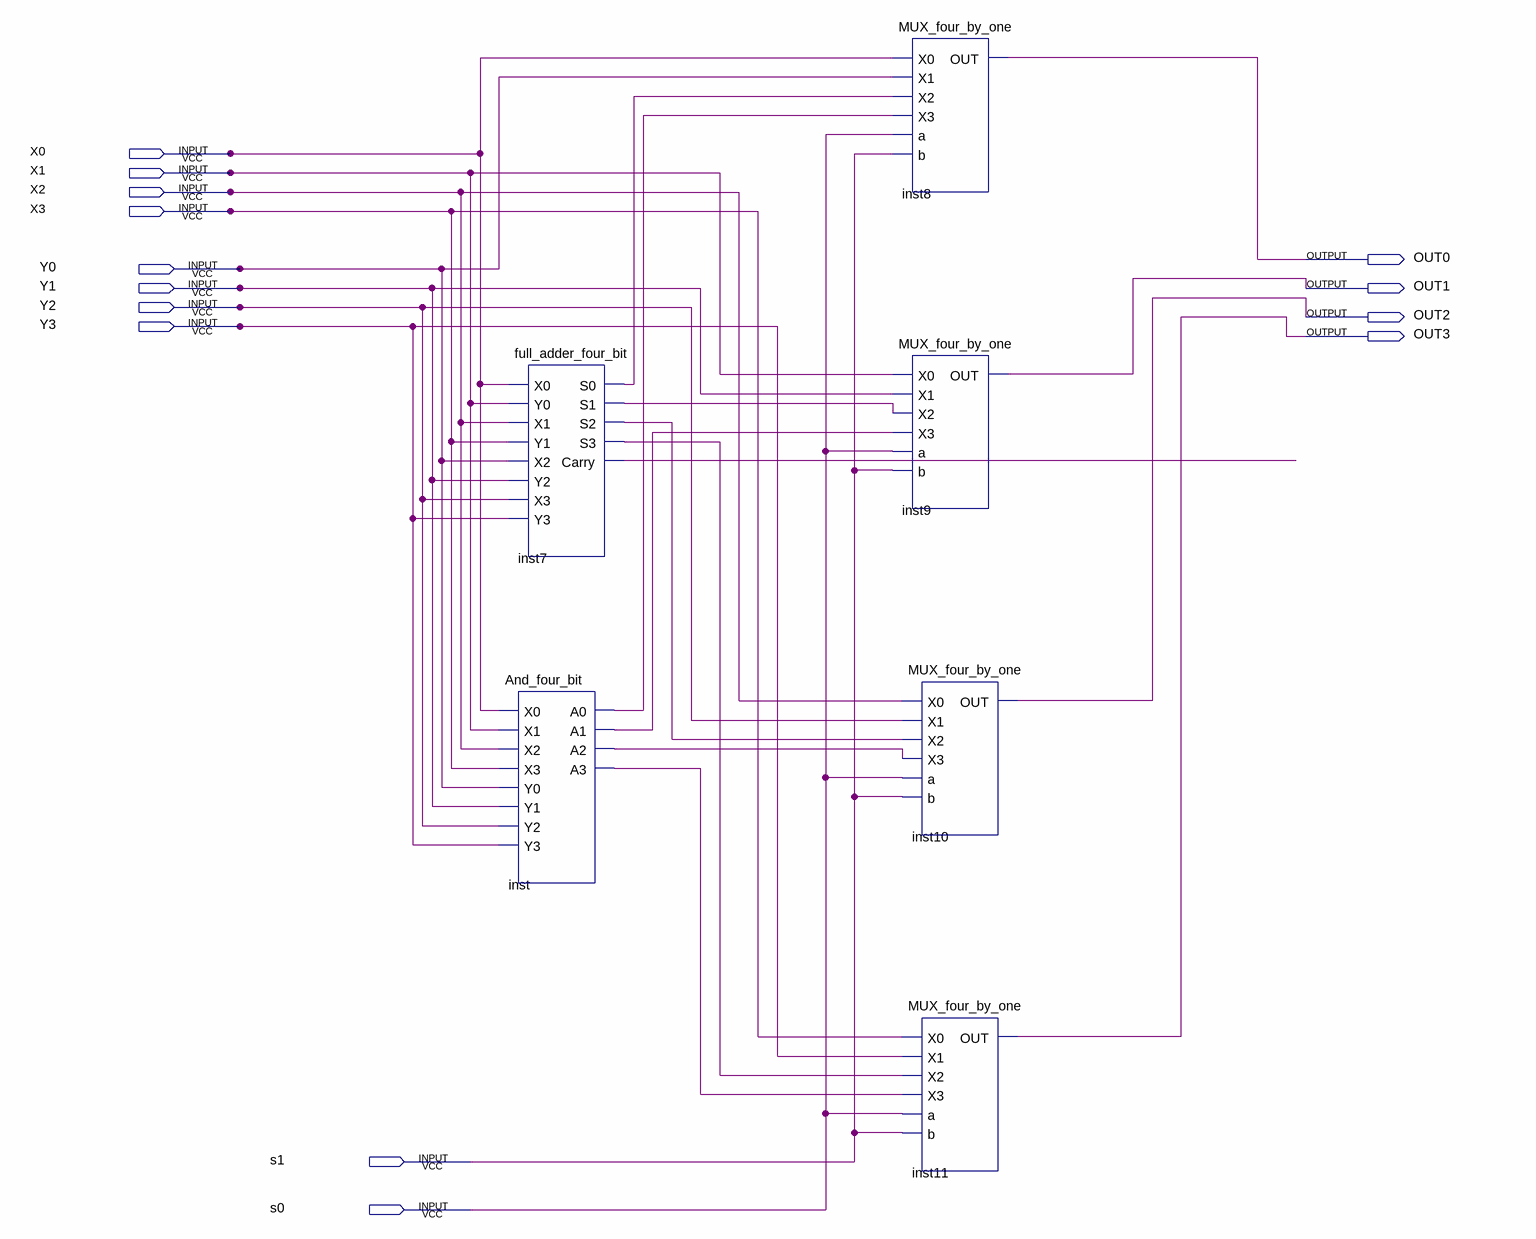
[diagram p0: schematic sheet]
// Quartus schematic ALU_inside.bdf as structural Verilog: 6 symbols, 14 pins
module ALU_inside (
  input  X0,
  input  X1,
  input  X2,
  input  X3,
  input  Y0,
  input  Y1,
  input  Y2,
  input  Y3,
  input  s1,
  input  s0,
  output OUT0,
  output OUT1,
  output OUT2,
  output OUT3
);

  wire inst7_carry, inst7_s0, inst7_s1, inst7_s2, inst7_s3, inst_a0, inst_a1, inst_a2, inst_a3;

  full_adder_four_bit inst7 (
    .X0(X0), .Y0(X1), .X1(X2), .Y1(X3), .X2(Y0), .Y2(Y1), .X3(Y2), .Y3(Y3), .S0(inst7_s0), .S1(inst7_s1),
    .S2(inst7_s2), .S3(inst7_s3), .Carry(inst7_carry));
  And_four_bit inst (
    .X0(X0), .X1(X1), .X2(X2), .X3(X3), .Y0(Y0), .Y1(Y1), .Y2(Y2), .Y3(Y3), .A0(inst_a0), .A1(inst_a1),
    .A2(inst_a2), .A3(inst_a3));
  MUX_four_by_one inst8 (.X0(X0), .X1(Y0), .X2(inst7_s0), .X3(inst_a0), .a(s0), .b(s1), .OUT(OUT0));
  MUX_four_by_one inst9 (.X0(X1), .X1(Y1), .X2(inst7_s1), .X3(inst_a1), .a(s0), .b(s1), .OUT(OUT1));
  MUX_four_by_one inst10 (.X0(X2), .X1(Y2), .X2(inst7_s2), .X3(inst_a2), .a(s0), .b(s1), .OUT(OUT2));
  MUX_four_by_one inst11 (.X0(X3), .X1(Y3), .X2(inst7_s3), .X3(inst_a3), .a(s0), .b(s1), .OUT(OUT3));
endmodule
